# EAGLE design Mabee_WS2812_8bit V1.1 (EAGLE 6.1)
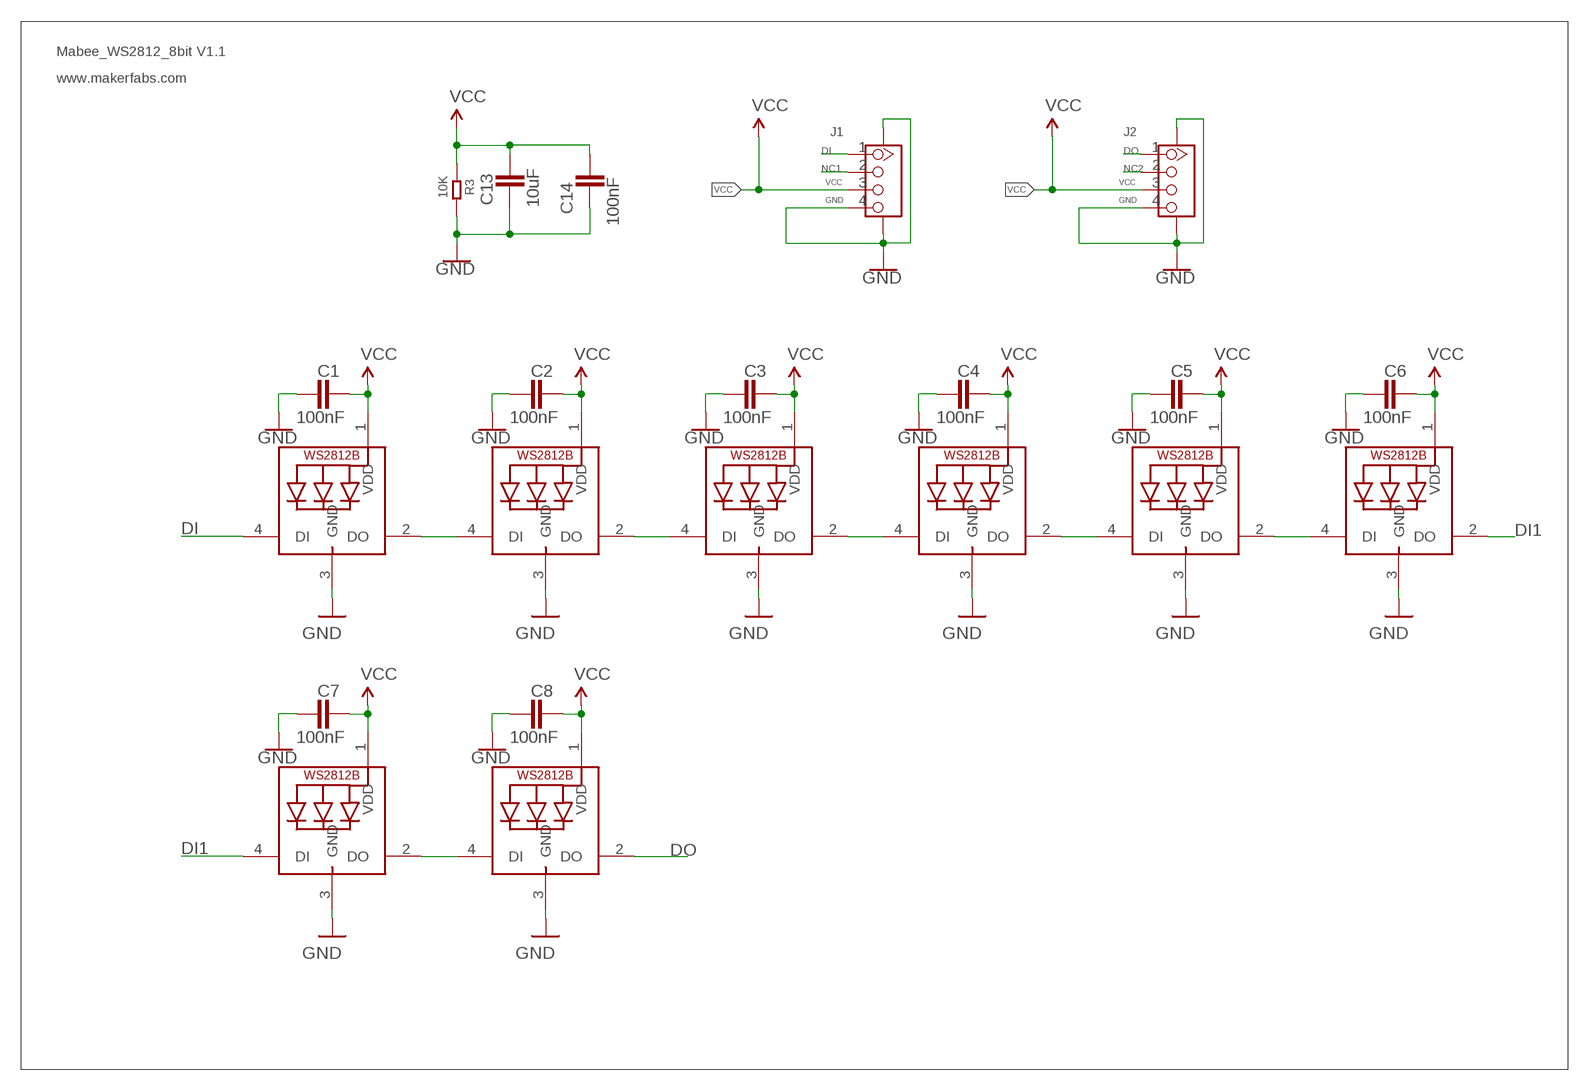
[diagram p0: schematic, sheet 1]

## Parts
C1  100nF  C-EUC0603  [C0603]
C2  100nF  C-EUC0603  [C0603]
C3  100nF  C-EUC0603  [C0603]
C4  100nF  C-EUC0603  [C0603]
C5  100nF  C-EUC0603  [C0603]
C6  100nF  C-EUC0603  [C0603]
C7  100nF  C-EUC0603  [C0603]
C8  100nF  C-EUC0603  [C0603]
C13  10uF  C-EUC0603  [C0603]
C14  100nF  C-EUC0603  [C0603]
J1  GROVE-CONNECTOR-SMD'90D'  [HW4-SMD-2.0-90D]
J2  GROVE-CONNECTOR-SMD'90D'  [HW4-SMD-2.0-90D]
LED0  WS2812B3535  [LED3535]
LED1  WS2812B3535  [LED3535]
LED2  WS2812B3535  [LED3535]
LED3  WS2812B3535  [LED3535]
LED4  WS2812B3535  [LED3535]
LED5  WS2812B3535  [LED3535]
LED6  WS2812B3535  [LED3535]
LED7  WS2812B3535  [LED3535]
R3  10K  R-0603  [R0603]

## Nets
DI: J1.1 LED0.4(DI)
DI1: LED5.2(DO) LED6.4(DI)
DO: J2.1 LED7.2(DO)
GND: C1.1 C2.1 C3.1 C4.1 C5.1 C6.1 C7.1 C8.1 C13.1 C14.1 J1.4 J1.SS1 J1.SS2 J2.4 J2.SS1 J2.SS2 LED0.3(GND) LED1.3(GND) LED2.3(GND) LED3.3(GND) LED4.3(GND) LED5.3(GND) LED6.3(GND) LED7.3(GND) R3.2
N$1: LED0.2(DO) LED1.4(DI)
N$2: LED1.2(DO) LED2.4(DI)
N$3: LED2.2(DO) LED3.4(DI)
N$4: LED3.2(DO) LED4.4(DI)
N$5: LED4.2(DO) LED5.4(DI)
N$7: LED6.2(DO) LED7.4(DI)
NC1: J1.2
NC2: J2.2
VCC: C1.2 C2.2 C3.2 C4.2 C5.2 C6.2 C7.2 C8.2 C13.2 C14.2 J1.3 J2.3 LED0.1(VDD) LED1.1(VDD) LED2.1(VDD) LED3.1(VDD) LED4.1(VDD) LED5.1(VDD) LED6.1(VDD) LED7.1(VDD) R3.1

## Notes on the sheet
- Mabee_WS2812_8bit V1.1
- www.makerfabs.com

## Library data of the parts
C1-C8 C13 C14 = rcl:C-EU: CAPACITOR, European symbol
J1 J2 = Connector-new:GROVE-CONNECTOR-SMD: 4P-SMD-2.0:320110030;4P-SMD-2.0-90D:320110032
LED0 LED1-LED7 = adafruit2:WS2812B
R3 = Discrete:R*

## Net classes
0 default: width 0.152 mm, drill 0.305 mm, clearance 0.152 mm

## Board
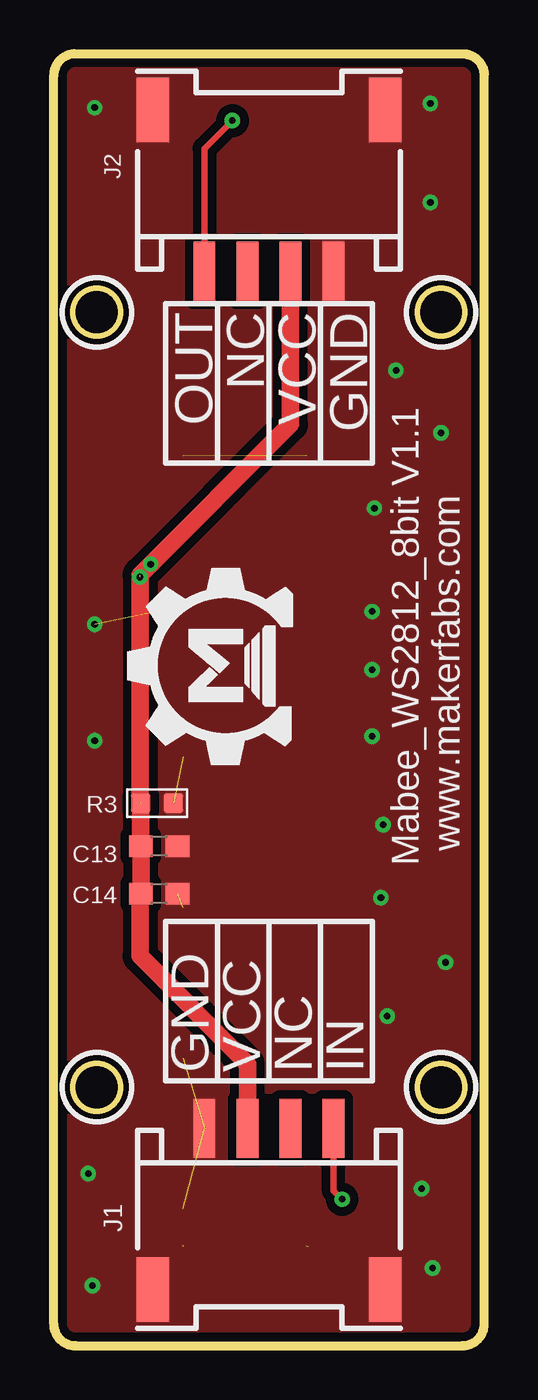
[diagram p1: board, top side]
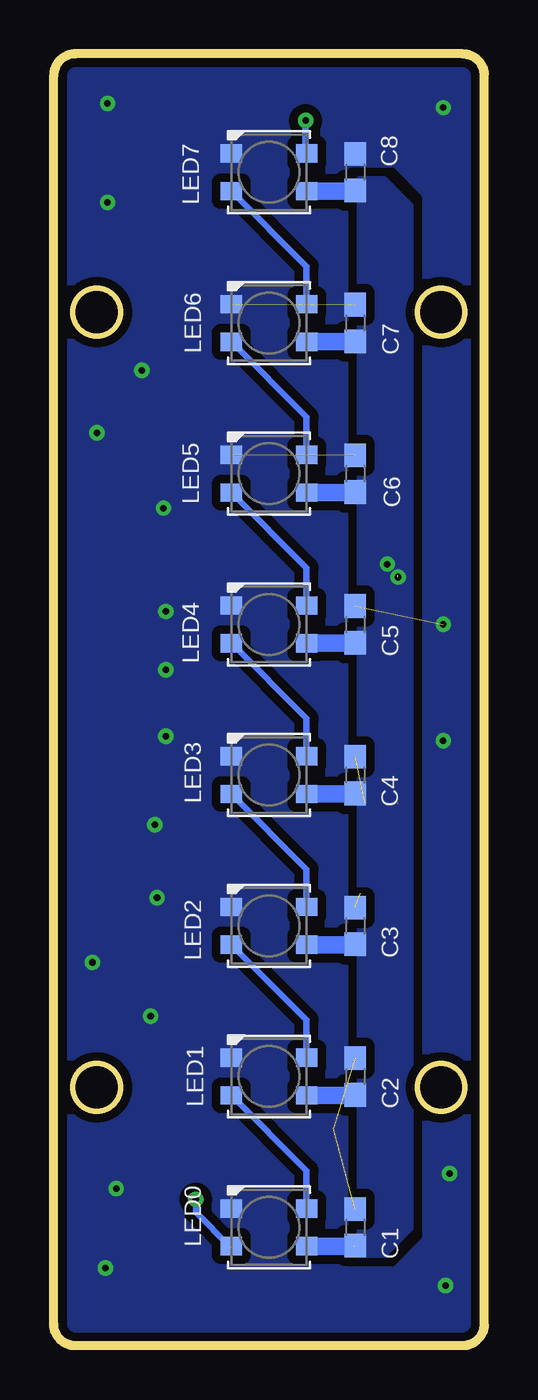
[diagram p2: board, bottom side, seen from below]

Size 20 x 60 mm. Coordinates in mm from the lower left corner, seen from the top.
Outline: 1,0 19,0 arc90 20,1 20,59 arc90 19,60 1,60 arc90 0,59 0,1 arc90 1,0
Outline: circle at 2,12 radius 1.1
Outline: circle at 18,12 radius 1.1
Outline: circle at 2,48 radius 1.1
Outline: circle at 18,48 radius 1.1
Copper layers (1*16): Top 0.035mm / dielectric 1.5mm / Bottom 0.035mm
Design rules: minimum track width 10mil, minimum drill 24mil, track to track 8mil, track to pad 8mil, pad to pad 8mil, via to via 8mil, smd to smd 8mil, copper to edge 10mil, drill to drill 8mil, minimum pad ring 10mil, minimum via ring 8mil, stop-mask expansion 4mil, vias tented up to drill 100mil, thermal gap 0mil

### Footprints (pad centres in the part's own frame; a part is rotated, then mirrored left to right if it is on the bottom)
C0603 = smd 1.1 x 1: 1 -0.85,0; 2 0.85,0
HW4-SMD-2.0-90D = smd 1.01 x 2.74: 1 -3,-0.1; 2 -1,-0.1; 3 1,-0.1; 4 3,-0.1 | smd 1.5 x 3: SS1 -5.4,7.4; SS2 5.4,7.4
LED3535 = smd 1 x 0.85: 1 -1.75,0.875; 2 -1.75,-0.875; 3 1.75,-0.875; 4 1.75,0.875
R0603 = smd 0.889 x 0.889: 1 -0.762,0; 2 0.762,0

### Placement (x,y rotation side)
C1  6,5.5 270 bottom
C2  6,12.5 270 bottom
C3  6,19.5 270 bottom
C4  6,26.5 270 bottom
C5  6,33.5 270 bottom
C6  6,40.5 270 bottom
C7  6,47.5 270 bottom
C8  6,54.5 270 bottom
C13  4.9,23.2 180 top
C14  4.9,21 180 top
J1  10,10 180 top
J2  10,50 0 top
LED0  10,5.5 180 bottom
LED1  10,12.5 180 bottom
LED2  10,19.5 180 bottom
LED3  10,26.5 180 bottom
LED4  10,33.5 180 bottom
LED5  10,40.5 180 bottom
LED6  10,47.5 180 bottom
LED7  10,54.5 180 bottom
R3  4.8,25.2 0 top
U$2  [MAKERFABS_0.3]  11.04,27.46 90 top

### Tracks (layer width: path | path; a pad name or v marks a point on that pad's centre or on a via)
DI  (via drill 0.3)  (1 unrouted)
  Top 0.305: J1.1 13,7.2 v13.4,6.8
  Bottom 0.305: v13.4,6.8 13.4,6.2 11.8,4.6
DI1
  Bottom 0.305: LED5.2 8.25,43.12 LED6.4
DO  (via drill 0.3)
  Top 0.305: v8.3,56.9 7,55.6 J2.1
  Bottom 0.305: v8.3,56.9 8.3,55.42 LED7.2
GND  (via drill 0.3)  (7 unrouted)
  other vias: 1.9,33.5 14.8,34.1 14.8,28.3 14.9,38.9 14.8,31.4 15.3,24.2 15.2,20.8 15.5,15.3 17.1,7.3 1.9,28.1 1.9,57.5 17.5,57.7 17.5,53.1 15.9,45.3 18.2,17.8 18,42.4 17.6,3.6 1.8,2.8 1.6,8
  pour Bottom (isolate 0.406, rank 3, no thermals): -1.6,34.8 -1.6,60.13 -0.33,61.4 7.4,61.4 20.33,61.4 21.6,60.13 21.6,41.2 21.6,-0.13 20.33,-1.4 9,-1.4 -0.33,-1.4 -1.6,-0.13 -1.6,34.6
  pour Top (isolate 0.406, rank 3, no thermals): -3.4,30.8 -3.4,61.53 -2.13,62.8 10.4,62.8 21.93,62.8 23.2,61.53 23.2,25.8 23.2,-1.73 21.93,-3 8.4,-3 -2.13,-3 -3.4,-1.73
N$1
  Bottom 0.305: LED0.2 8.25,8.12 LED1.4
N$2
  Bottom 0.305: LED1.2 8.25,15.12 LED2.4
N$3
  Bottom 0.305: LED2.2 8.25,22.12 LED3.4
N$4
  Bottom 0.305: LED3.2 8.25,29.12 LED4.4
N$5
  Bottom 0.305: LED4.2 8.25,36.12 LED5.4
N$7
  Bottom 0.305: LED6.2 8.25,50.12 LED7.4
VCC  (via drill 0.3)  (3 unrouted)
  Top 0.813: J1.3 9,13.1 4,18.1 4,20.95 C14.2 C13.2 4.04,23.21 R3.1 | 4.05,35.85 11,42.8 J2.3 | 4.05,35.85 | 4.05,35.85 4,35.8 4,25.2
  Bottom 0.813: LED0.1 6.03,4.62 6,4.6 | LED1.1 6.03,11.62 C2.2 | LED2.1 6.03,18.62 C3.2 | LED3.1 6.03,25.62 C4.2 | LED4.1 6.03,32.62 C5.2 | LED5.1 6.03,39.62 C6.2 | LED6.1 6.03,46.62 C7.2 | LED7.1 6.03,53.62 C8.2
  other vias: 4,35.7 4.5,36.3
  pour Bottom (isolate 0.406, no thermals): 3.4,35.6 3.4,52.93 4.67,54.2 5.2,54.2 5.8,54.2 5.8,4.2 4.67,4.2 3.4,5.47

### Text on the board
tPlace: Mabee_WS2812_8bit V1.1 | www.makerfabs.com
tNames: OUT | NC | VCC | GND | GND | VCC | NC | IN